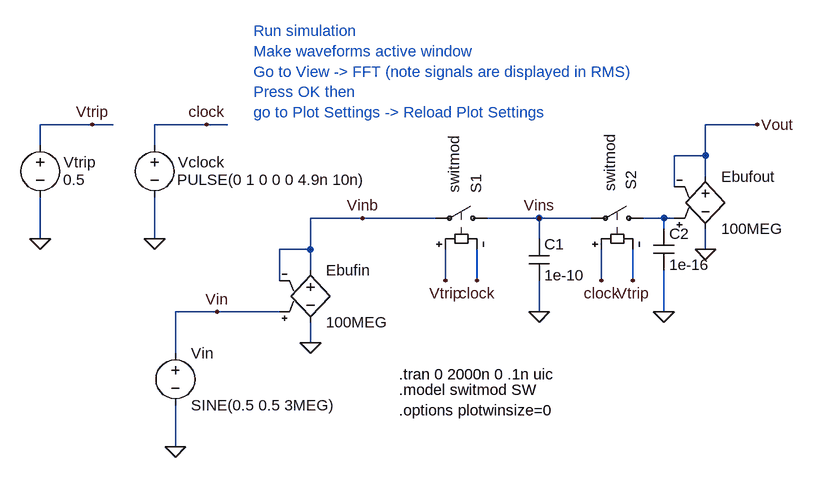
[diagram p0: schematic _Fig2_18_MSD.asc]
_Fig2_18_MSD.asc, the LTspice schematic file:
Version 4
SHEET 1 1344 696
WIRE 160 32 80 32
WIRE 192 32 160 32
WIRE 336 32 256 32
WIRE 368 32 336 32
WIRE 1184 32 1104 32
WIRE 80 64 80 32
WIRE 256 64 256 32
WIRE 1104 80 1104 32
WIRE 1104 80 1056 80
WIRE 1104 112 1104 80
WIRE 1056 128 1056 80
WIRE 576 176 496 176
WIRE 688 176 576 176
WIRE 848 176 768 176
WIRE 928 176 848 176
WIRE 1040 176 1008 176
WIRE 1056 176 1040 176
WIRE 1040 192 1040 176
WIRE 80 208 80 144
WIRE 256 208 256 144
WIRE 848 208 848 176
WIRE 496 224 496 176
WIRE 496 224 448 224
WIRE 1104 224 1104 192
WIRE 496 256 496 224
WIRE 448 272 448 224
WIRE 704 272 704 224
WIRE 752 272 752 224
WIRE 944 272 944 224
WIRE 992 272 992 224
WIRE 352 320 288 320
WIRE 448 320 352 320
WIRE 848 320 848 272
WIRE 1040 320 1040 256
WIRE 496 368 496 336
WIRE 288 384 288 320
WIRE 288 528 288 464
FLAG 288 528 0
FLAG 352 320 Vin
FLAG 496 368 0
FLAG 576 176 Vinb
FLAG 848 176 Vins
FLAG 704 272 Vtrip
FLAG 752 272 clock
FLAG 80 208 0
FLAG 160 32 Vtrip
FLAG 256 208 0
FLAG 336 32 clock
FLAG 1104 224 0
FLAG 1184 32 Vout
FLAG 848 320 0
FLAG 944 272 clock
FLAG 992 272 Vtrip
FLAG 1040 320 0
SYMBOL voltage 288 368 R0
WINDOW 123 0 0 Left 0
WINDOW 39 0 0 Left 0
SYMATTR InstName Vin
SYMATTR Value SINE(0.5 0.5 3MEG)
SYMBOL e2 496 240 R0
SYMATTR InstName Ebufin
SYMATTR Value 100MEG
SYMBOL sw 784 176 M270
WINDOW 3 24 -12 Left 0
WINDOW 38 39 67 Left 0
WINDOW 0 38 33 Left 0
SYMATTR Value ""
SYMATTR SpiceModel switmod
SYMATTR InstName S1
SYMBOL voltage 80 48 R0
WINDOW 0 36 42 Left 0
WINDOW 3 35 69 Left 0
WINDOW 123 0 0 Left 0
WINDOW 39 0 0 Left 0
SYMATTR InstName Vtrip
SYMATTR Value 0.5
SYMBOL voltage 256 48 R0
WINDOW 0 36 42 Left 0
WINDOW 3 35 69 Left 0
WINDOW 123 0 0 Left 0
WINDOW 39 0 0 Left 0
SYMATTR InstName Vclock
SYMATTR Value PULSE(0 1 0 0 0 4.9n 10n)
SYMBOL e2 1104 96 R0
SYMATTR InstName Ebufout
SYMATTR Value 100MEG
SYMBOL cap 832 208 R0
SYMATTR InstName C1
SYMATTR Value 1e-10
SYMBOL sw 1024 176 M270
WINDOW 3 24 -12 Left 0
WINDOW 38 41 67 Left 0
WINDOW 0 44 35 Left 0
SYMATTR Value ""
SYMATTR SpiceModel switmod
SYMATTR InstName S2
SYMBOL cap 1024 192 R0
SYMATTR InstName C2
SYMATTR Value 1e-16
TEXT 632 416 Left 0 !.tran 0 2000n 0 .1n uic
TEXT 632 440 Left 0 !.model switmod SW\n.options plotwinsize=0
TEXT 408 -112 Left 0 ;Run simulation\nMake waveforms active window\nGo to View -> FFT (note signals are displayed in RMS)\nPress OK then \ngo to Plot Settings -> Reload Plot Settings

The netlist it stands for:
* _Fig2_18_MSD.asc
Vin Vin 0 SINE(0.5 0.5 3MEG)
Ebufin Vinb 0 Vin Vinb 100MEG
S1 Vins Vinb Vtrip clock switmod
Vtrip Vtrip 0 0.5
Vclock clock 0 PULSE(0 1 0 0 0 4.9n 10n)
Ebufout Vout 0 N001 Vout 100MEG
C1 Vins 0 1e-10
S2 N001 Vins clock Vtrip switmod
C2 N001 0 1e-16
.tran 0 2000n 0 .1n uic
.model switmod SW
.options plotwinsize=0
* Run simulation
* Make waveforms active window
* Go to View -> FFT (note signals are displayed in RMS)
* Press OK then
* go to Plot Settings -> Reload Plot Settings
.backanno
.end